# EAGLE schematic adafruit oled featherwing (EAGLE 6.4)
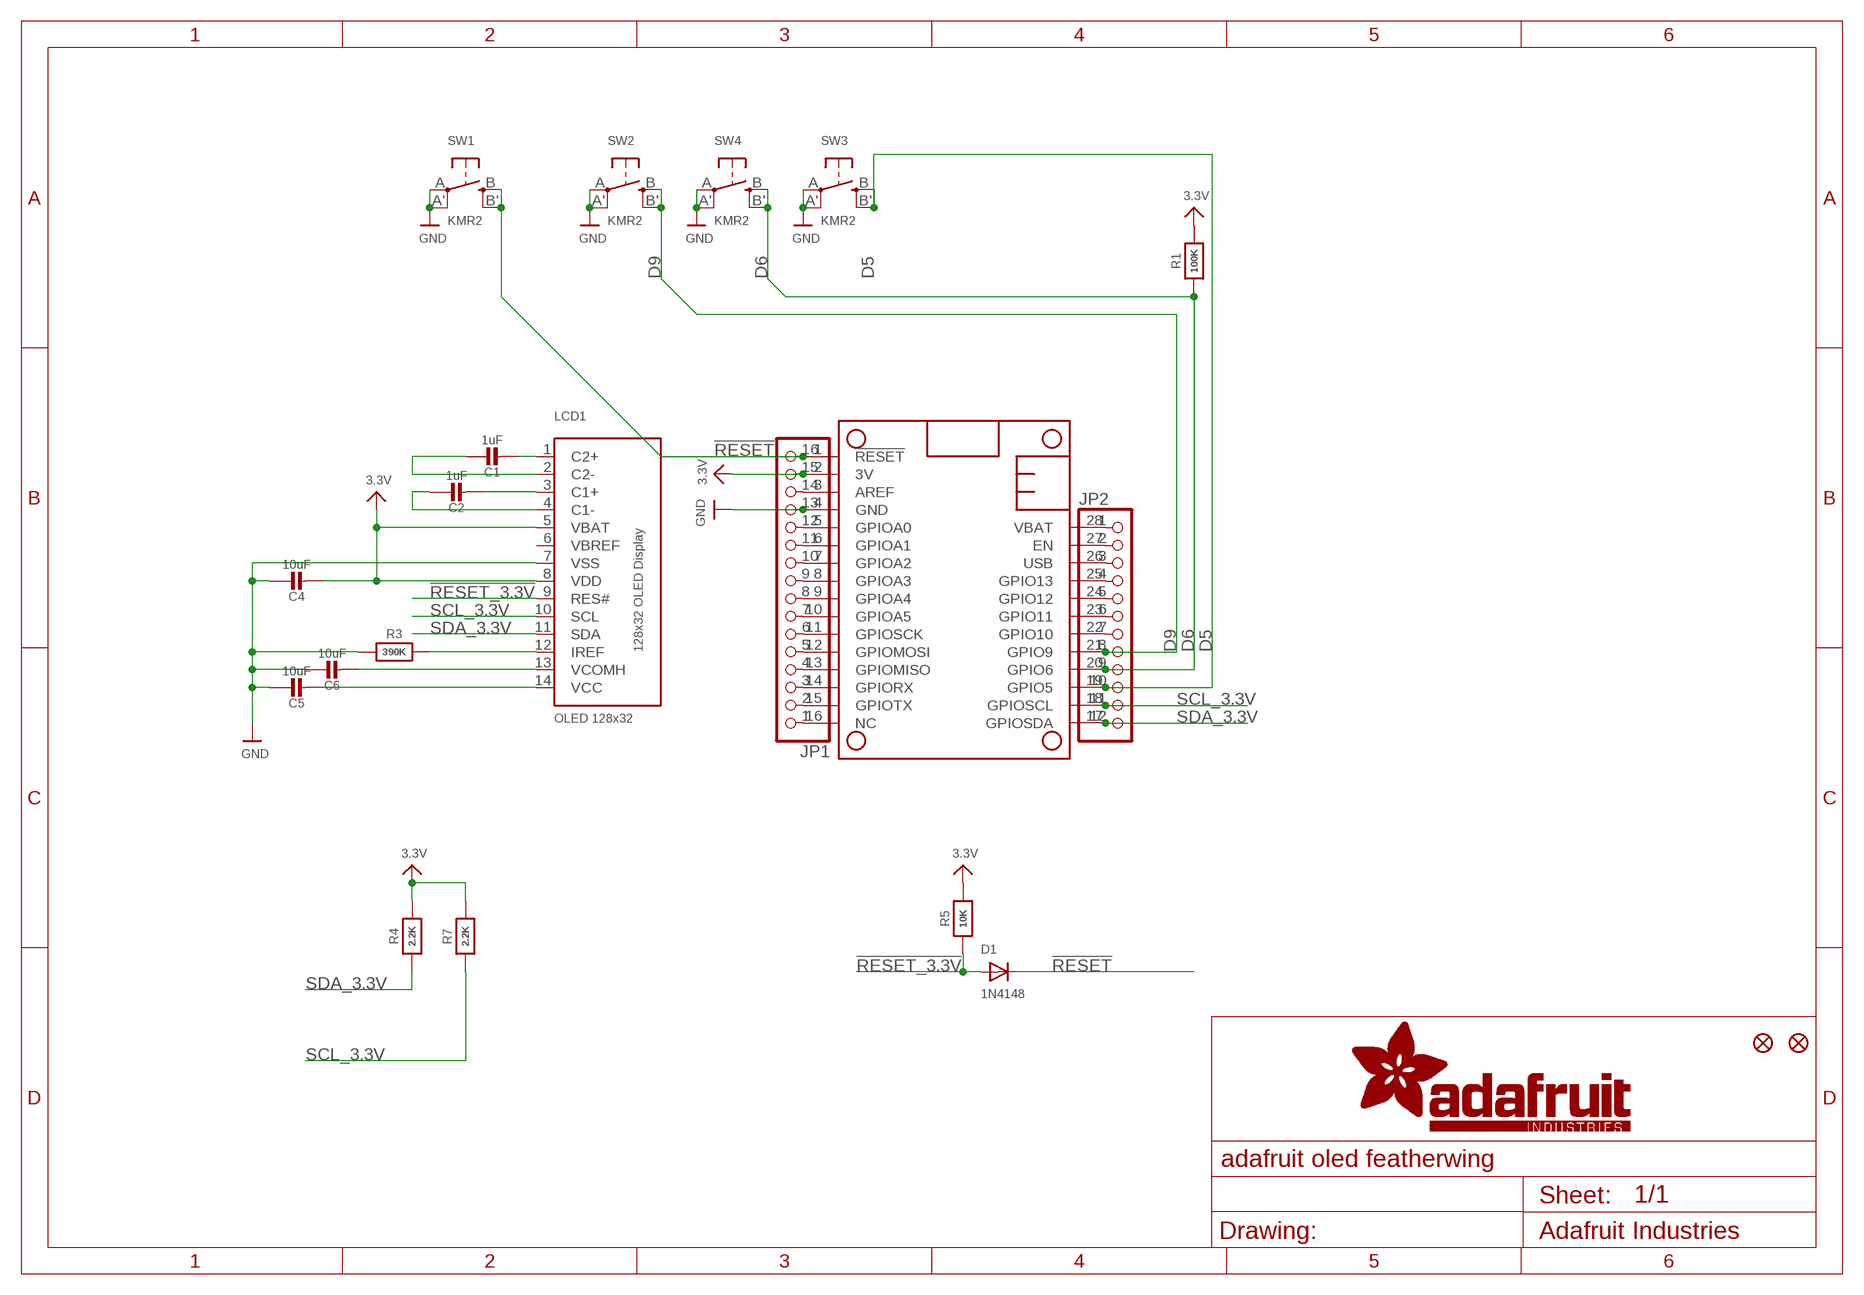
[diagram p0: schematic, sheet 1]

## Parts
C1  1uF  CAP_CERAMIC0805-NOOUTLINE  [0805-NO]
C2  1uF  CAP_CERAMIC0805-NOOUTLINE  [0805-NO]
C4  10uF  CAP_CERAMIC0805-NOOUTLINE  [0805-NO]
C5  10uF  CAP_CERAMIC0805-NOOUTLINE  [0805-NO]
C6  10uF  CAP_CERAMIC0805-NOOUTLINE  [0805-NO]
D1  1N4148  DIODESOD-323F  [SOD-323F]
FID1  FIDUCIAL""  [FIDUCIAL_1MM]
FID2  FIDUCIAL""  [FIDUCIAL_1MM]
JP1  HEADER-1X16ROUND  [1X16_ROUND]
JP2  HEADER-1X12  [1X12_ROUND]
LCD1  OLED 128x32  DISP_OLED_UG-2832HSWEG02  [UG-2832HSWEG02_WRAPUNDER]
MS1  FEATHERWING  [FEATHERWING]
R1  100K  RESISTOR_0805MP  [_0805MP]
R3  390K  RESISTOR0805_NOOUTLINE  [0805-NO]
R4  2.2K  RESISTOR0805_NOOUTLINE  [0805-NO]
R5  10K  RESISTOR0805_NOOUTLINE  [0805-NO]
R7  2.2K  RESISTOR0805_NOOUTLINE  [0805-NO]
SW1  KMR2  SWITCH_TACT_SMT4.6X2.8  [BTN_KMR2_4.6X2.8]
SW2  KMR2  SWITCH_TACT_SMT4.6X2.8  [BTN_KMR2_4.6X2.8]
SW3  KMR2  SWITCH_TACT_SMT4.6X2.8  [BTN_KMR2_4.6X2.8]
SW4  KMR2  SWITCH_TACT_SMT4.6X2.8  [BTN_KMR2_4.6X2.8]

## Nets
3.3V: C4.2 JP1.15 LCD1.5(VBAT) LCD1.8(VDD) MS1.2(3V) R1.2 R4.2 R5.2 R7.2
!RESET: D1.C JP1.16 MS1.1(!RESET) SW1.B'(S1) SW1.B(S)
!RESET_3.3V: D1.A LCD1.9(RES#) R5.1
D5: JP2.10 MS1.19(GPIO5) SW3.B'(S1) SW3.B(S)
D6: JP2.9 MS1.20(GPIO6) R1.1 SW4.B'(S1) SW4.B(S)
D9: JP2.8 MS1.21(GPIO9) SW2.B'(S1) SW2.B(S)
GND: C4.1 C5.1 C6.1 JP1.13 LCD1.7(VSS) MS1.4(GND) R3.1 SW1.A'(P1) SW1.A(P) SW2.A'(P1) SW2.A(P) SW3.A'(P1) SW3.A(P) SW4.A'(P1) SW4.A(P)
N$1: C1.2 LCD1.1(C2+)
N$2: C1.1 LCD1.2(C2-)
N$3: C2.2 LCD1.3(C1+)
N$4: C2.1 LCD1.4(C1-)
N$5: C6.2 LCD1.13(VCOMH)
N$6: C5.2 LCD1.14(VCC)
N$7: LCD1.12(IREF) R3.2
N$8: JP1.1 MS1.16(NC)
N$9: JP1.2 MS1.15(GPIOTX)
N$10: JP1.3 MS1.14(GPIORX)
N$11: JP1.4 MS1.13(GPIOMISO)
N$12: JP1.5 MS1.12(GPIOMOSI)
N$13: JP1.6 MS1.11(GPIOSCK)
N$14: JP1.7 MS1.10(GPIOA5)
N$15: JP1.8 MS1.9(GPIOA4)
N$16: JP1.9 MS1.8(GPIOA3)
N$17: JP1.10 MS1.7(GPIOA2)
N$18: JP1.11 MS1.6(GPIOA1)
N$19: JP1.12 MS1.5(GPIOA0)
N$20: JP1.14 MS1.3(AREF)
N$21: JP2.2 MS1.27(EN)
N$22: JP2.4 MS1.25(GPIO13)
N$23: JP2.5 MS1.24(GPIO12)
N$24: JP2.6 MS1.23(GPIO11)
N$25: JP2.7 MS1.22(GPIO10)
SCL_3.3V: JP2.11 LCD1.10(SCL) MS1.18(GPIOSCL) R7.1
SDA_3.3V: JP2.12 LCD1.11(SDA) MS1.17(GPIOSDA) R4.1
USB: JP2.3 MS1.26(USB)
VBAT: JP2.1 MS1.28(VBAT)

## Power pins joined to a net without a drawn wire
VBREF: LCD1.6(VBREF)

## Library data of the parts
C1 C2 C4-C6 = microbuilder:CAP_CERAMIC: Ceramic Capacitors For new designs, use the packages preceded by an '_' character since they are more reliable: The following footprints should be used on most boards: _0402 - Standard footprint for regular board layouts _0603 - Standard footprint for regular board layouts _0805 - Standard footprint for regular board layouts _1206 - Standard footprint for regular board layouts For extremely tight-pitch boards where space is at a premium, the following 'micro-pitch' footprints can be used (smaller pads, no silkscreen outline, etc.): _0402MP - Micro-pitch footprint for very dense/compact boards _0603MP - Micro-pitch footprint for very dense/compact boards _0805MP - Micro-pitch footprint for very dense/compact boards _1206MP - Micro-pitch footprint for very dense/compact boards
D1 = adafruit:DIODE: Diode SMADIODE - SMA Surface Mount Package 20V 1A Schottky Diode Digikey: 641-1014-6-ND DO-1N4148 - Through Hole Small Current Diode SOD-123 20V 1 A (.5mV Vf) Schottky Diode - Digikey: MBRX120TPMSCT-ND SOD-323 10V 570mA (.38mV Vf, 3ns) Schottky Diode - Digikey: ZLLS410CT-ND SOD-523 30V 30mA Schottky Diode (RB751S-40TE61) - Digikey: RB751S-40TE61CT-ND SOT23-R/W - SOT23 Package (R = Solder Paste/Reflow Ovens, W = Hand-Soldering) BAT54Film 40V 300mA - Digikey: 497-7162-1-ND
FID1 FID2 = microbuilder:FIDUCIAL: Fiducial Alignment Points Various fiducial points for machine vision alignment.; BOM: EXCLUDE
JP1 = microbuilder:HEADER-1X16: PIN HEADER
JP2 = microbuilder:HEADER-1X12
LCD1 = microbuilder:DISP_OLED_UG-2832HSWEG02: 128x32 I2C 0.91" Monochrome OLED Display
MS1 = microbuilder:FEATHERWING
R1 R3-R5 R7 = microbuilder:RESISTOR: Resistors For new designs, use the packages preceded by an '_' character since they are more reliable: The following footprints should be used on most boards: _0402 - Standard footprint for regular board layouts _0603 - Standard footprint for regular board layouts _0805 - Standard footprint for regular board layouts _1206 - Standard footprint for regular board layouts For extremely tight-pitch boards where space is at a premium, the following 'micro-pitch' footprints can be used (smaller pads, no silkscreen outline, etc.): _0402MP - Micro-pitch footprint for very dense/compact boards _0603MP - Micro-pitch footprint for very dense/compact boards _0805MP - Micro-pitch footprint for very dense/compact boards _1206MP - Micro-pitch footprint for very dense/compact boards
SW1-SW4 = microbuilder:SWITCH_TACT_SMT: SMT Tact Switches 6x6mm - Digikey: P12940SCT-ND KMR2 (4.6x2.8mm) - Digikey: 401-1426-1-ND EVQ-PQHB55 - Light Touch, 160GF (4.5x4.5mm) - Digikey: P8090SCT-ND KMT0 - KMT021 NGJ LHS (etc.) IP68/Waterproof - Digikey: CKN10289CT-ND